# Altium schematic sheet Battery_PCB_AR21.SchDoc
size A4
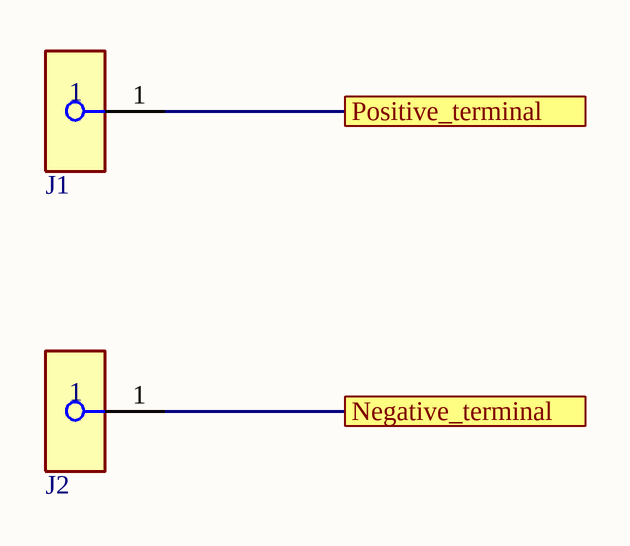
[diagram p0: Battery_PCB_AR21.SchDoc]

## Parts
J1  74655095R  [Wurth_Electronics_74655095R_MFG]  (value not drawn)
J2  74655095R  [Wurth_Electronics_74655095R_MFG]  (value not drawn)

## Ports
Negative_terminal, Positive_terminal

## Nets
Negative_terminal: J2.1 ; port Negative_terminal
Positive_terminal: J1.1 ; port Positive_terminal

## Library data of the parts
J1 J2 = 74655095R: WP-THRSH 8 Pin PCB Screw Terminal, 85A, Solder, M5, Vertical; Manufacturer: Wurth Electronics; Conn Gender: Female; Is Female: yes; Number Of Contacts: 1; Standoff Height: 0.4mm; Symbol Hash: 98815daf2f2c152b0c43f5ab9800df6025b93842f7f4dce5b4a57c59fb716133; Verification Version: 0.0.0.3; Datasheet Path: datasheets/Conn_Wurth_Electronics_74655095R_eec.pdf; Automotive: No; ComponentLink1Description: Upverter; ComponentLink1URL: https://upverter.com/part/id/4bf0a128140124e6/; ComponentLink2Description: Datasheet; ComponentLink2URL: https://katalog.we-online.com/em/datasheet/74655095R.pdf; Conn Orientation: Vertical; Contact Material: Tin; Current Rating: 85A; Digikey Description: BUSH, THR_OPEN; Digikey Part Number: 732-10903-1-ND; Height: 4.7mm; Lead Free: Yes; Mouser Part Number: 710-74655095R; Package: 74655095R; Part Number: 74655095R; RoHS: TRUE; Supplier 1: Digi-Key; Supplier 2: Mouser; Supplier Part Number 1: 732-10903-1-ND; Supplier Part Number 2: 710-74655095R; Temperature: -55°C to +150°C; Temperature Range High: +150°C; Temperature Range Low: -55°C; helpURL: https://upverter.com/part/id/4bf0a128140124e6/